# EAGLE design STMConnector (EAGLE 9.3.2)
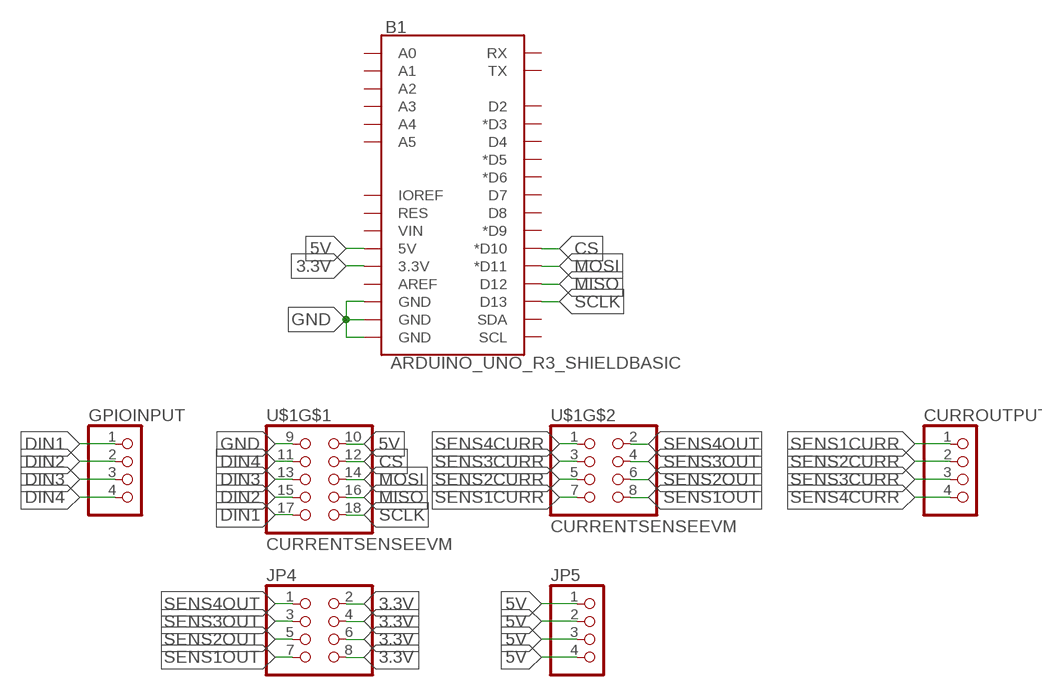
[diagram p0: schematic, sheet 1]

## Parts
B1  ARDUINO_UNO_R3_SHIELDBASIC  [UNO_R3_SHIELD]
CURROUTPUT  PINHD-1X4  [1X04]
GPIOINPUT  PINHD-1X4  [1X04]
JP4  PINHD-2X4  [2X04]
JP5  PINHD-1X4  [1X04]
U$1  CURRENTSENSEEVM  [CURRENTSENSEEVM]

## Nets
3.3V: B1.3.3V JP4.2 JP4.4 JP4.6 JP4.8
5V: B1.5V JP5.1 JP5.2 JP5.3 JP5.4 U$1.10
CS: B1.D10(*D10) U$1.12
DIN1: GPIOINPUT.1 U$1.17
DIN2: GPIOINPUT.2 U$1.15
DIN3: GPIOINPUT.3 U$1.13
DIN4: GPIOINPUT.4 U$1.11
GND: B1.GND@0(GND) B1.GND@1(GND) B1.GND@2(GND) U$1.9
MISO: B1.D12 U$1.16
MOSI: B1.D11(*D11) U$1.14
SCLK: B1.D13 U$1.18
SENS1CURR: CURROUTPUT.1 U$1.7
SENS1OUT: JP4.7 U$1.8
SENS2CURR: CURROUTPUT.2 U$1.5
SENS2OUT: JP4.5 U$1.6
SENS3CURR: CURROUTPUT.3 U$1.3
SENS3OUT: JP4.3 U$1.4
SENS4CURR: CURROUTPUT.4 U$1.1
SENS4OUT: JP4.1 U$1.2
Unconnected: B1.A0 B1.A1 B1.A2 B1.A3 B1.A4 B1.A5 B1.AREF B1.D2 B1.D3(*D3) B1.D4 B1.D5(*D5) B1.D6(*D6) B1.D7 B1.D8 B1.D9(*D9) B1.IOREF B1.RES B1.RX B1.SCL B1.SDA B1.TX B1.VIN

## Library data of the parts
B1 = SparkFun-Boards:ARDUINO_UNO_R3_SHIELD: Arduino R3 Shield Footprint Shield form compatible with the Arduino Uno R3. SparkFun Products: MG2639 Cellular Shield <https://www.sparkfun.com/products/13120> MIDI Shield <https://www.sparkfun.com/products/12898> R3 Stackable Headers Kit <https://www.sparkfun.com/products/11417>
CURROUTPUT GPIOINPUT JP5 = pinhead-currentsense:PINHD-1X4: PIN HEADER
JP4 = pinhead-currentsense:PINHD-2X4: PIN HEADER
U$1 = pinhead-currentsense:CURRENTSENSEEVM

## Board
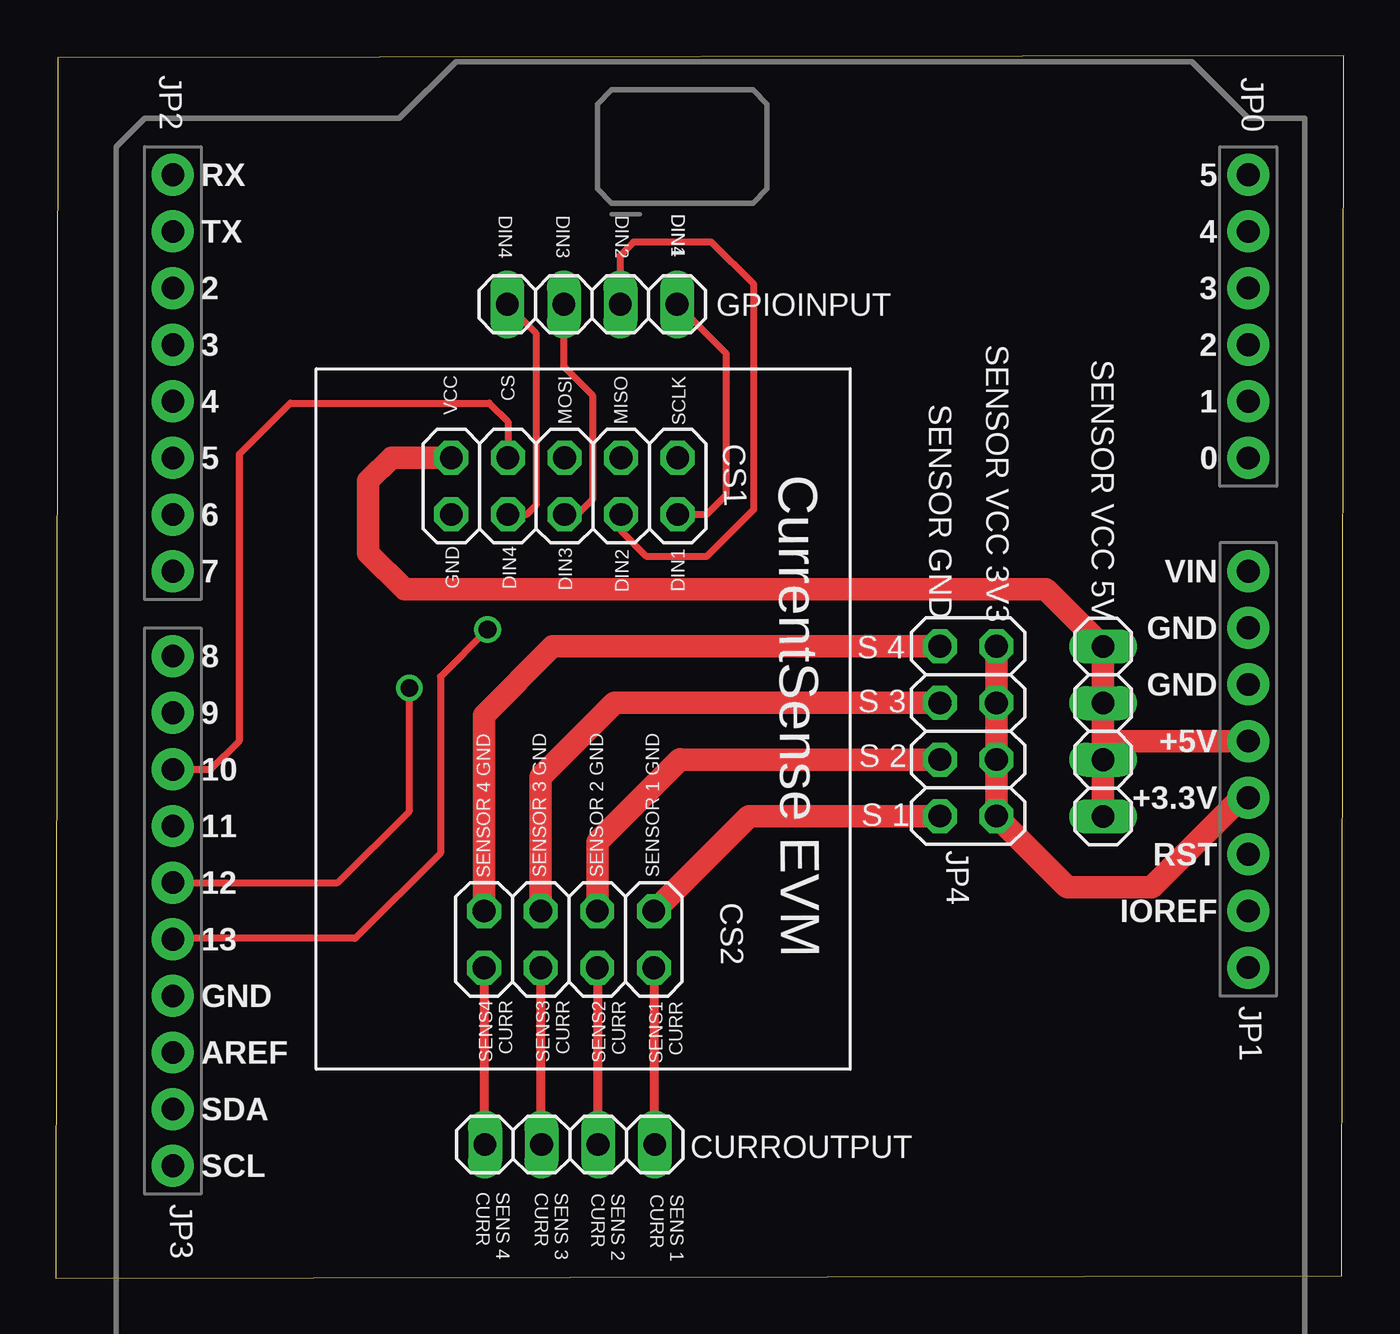
[diagram p1: board, top side]
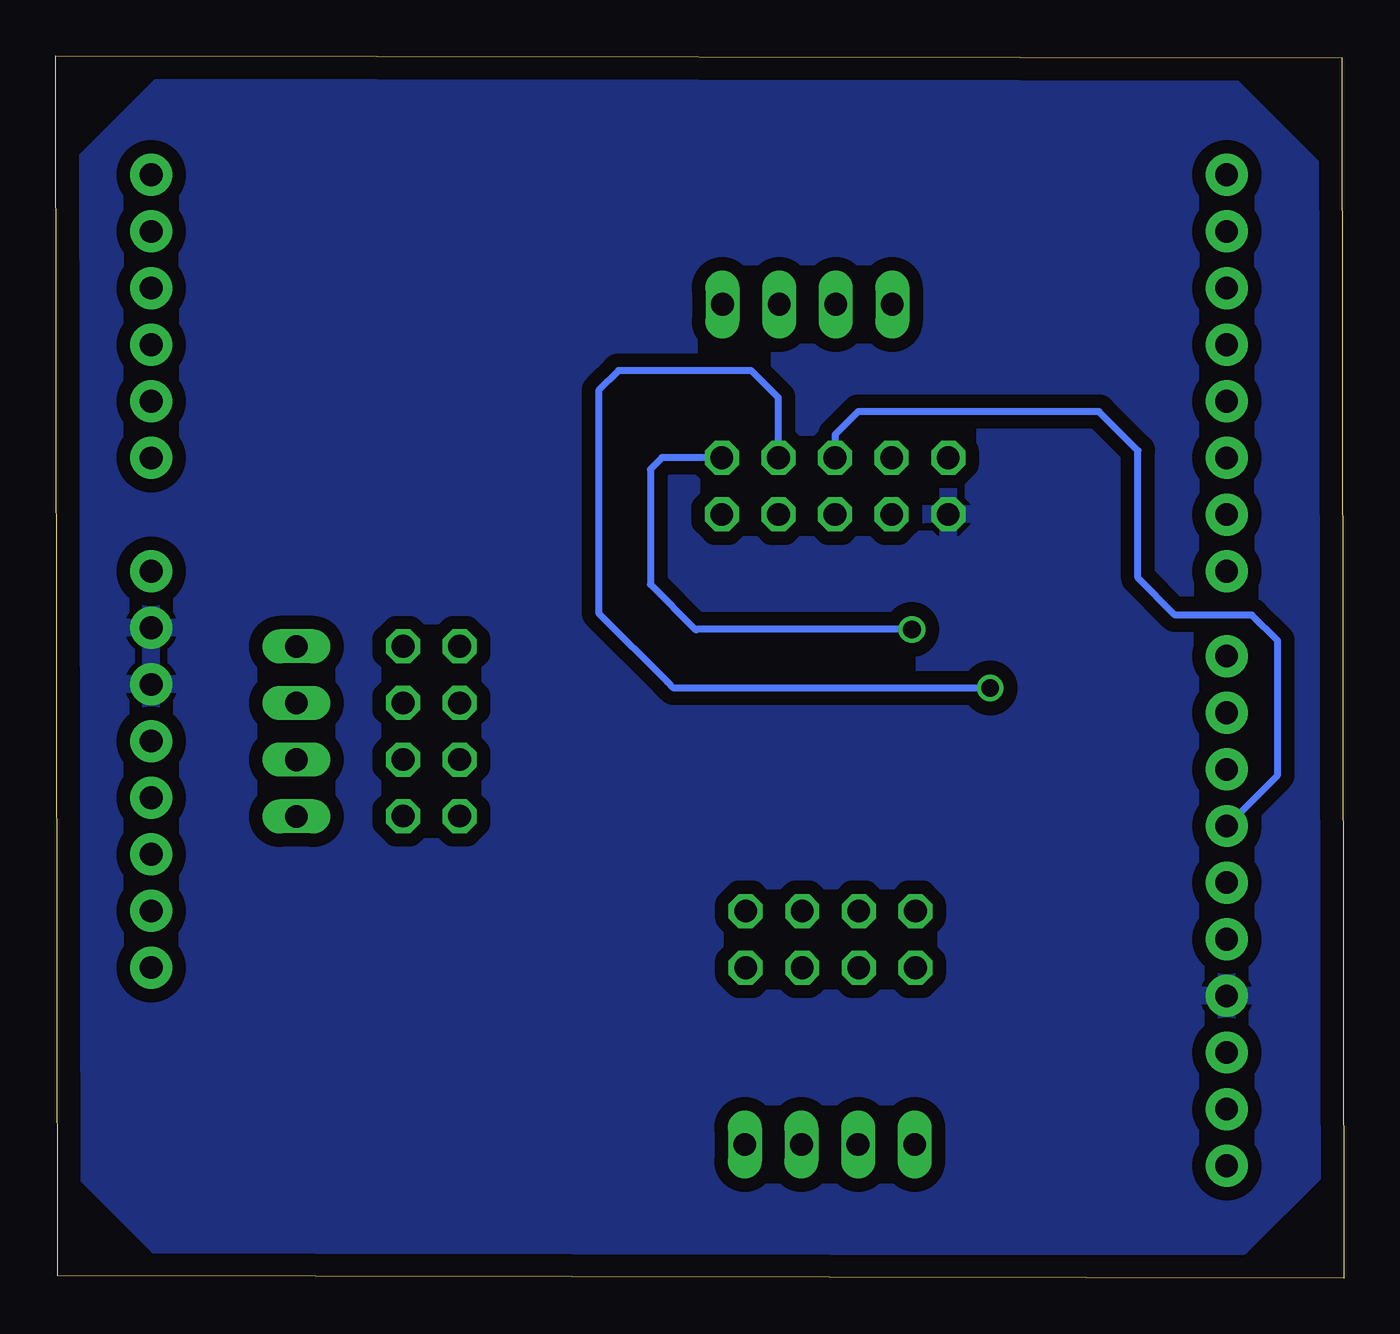
[diagram p2: board, bottom side, seen from below]

Size 57.8 x 54.83 mm. Coordinates in mm from the lower left corner, seen from the top.
Outline: 0,0 57.7,0.1 57.8,54.83 0.1,54.73 0,0
Copper layers (1*16): Top 0.035mm / dielectric 1.5mm / Bottom 0.035mm
Design rules "default": minimum track width 6mil, minimum drill 0.35mm, track to track 6mil, track to pad 6mil, pad to pad 6mil, via to via 6mil, smd to smd 6mil, copper to edge 40mil, drill to drill 6mil, minimum pad ring 10mil, minimum via ring 8mil, stop-mask expansion 4mil, vias tented up to drill 0mil, thermal gap 10mil

### Footprints (pad centres in the part's own frame; a part is rotated, then mirrored left to right if it is on the bottom)
UNO_R3_SHIELD = drill 1.016 pad 1.88: 3.3V 24.13,-2.54; 5V 24.13,0; A0 24.13,12.7; A1 24.13,15.24; A2 24.13,17.78; A3 24.13,20.32; A4 24.13,22.86; A5 24.13,25.4; AREF -24.13,-13.97; D2 -24.13,20.32; D3 -24.13,17.78; D4 -24.13,15.24; D5 -24.13,12.7; D6 -24.13,10.16; D7 -24.13,7.62; D8 -24.13,3.81; D9 -24.13,1.27; D10 -24.13,-1.27; D11 -24.13,-3.81; D12 -24.13,-6.35; D13 -24.13,-8.89; GND@0 24.13,2.54; GND@1 24.13,5.08; GND@2 -24.13,-11.43; IOREF 24.13,-7.62; NC 24.13,-10.16; RES 24.13,-5.08; RX -24.13,25.4; SCL -24.13,-19.05; SDA -24.13,-16.51; TX -24.13,22.86; VIN 24.13,7.62
1X04 = drill 1.016 long: 1 -3.81,0; 2 -1.27,0; 3 1.27,0; 4 3.81,0
2X04 = drill 1.016 octagon: 1 -3.81,-1.27; 2 -3.81,1.27; 3 -1.27,-1.27; 4 -1.27,1.27; 5 1.27,-1.27; 6 1.27,1.27; 7 3.81,-1.27; 8 3.81,1.27
CURRENTSENSEEVM = drill 1.016 octagon: 1 24.147,2.742; 2 21.607,2.742; 3 24.147,5.282; 4 21.607,5.282; 5 24.147,7.822; 6 21.607,7.822; 7 24.147,10.362; 8 21.607,10.362; 9 3.81,1.27; 10 1.27,1.27; 11 3.81,3.81; 12 1.27,3.81; 13 3.81,6.35; 14 1.27,6.35; 15 3.81,8.89; 16 1.27,8.89; 17 3.81,11.43; 18 1.27,11.43

### Placement (x,y rotation side)
B1  29.39,24.09 0 top
CURROUTPUT  23.07,5.99 180 top
GPIOINPUT  24.07,43.68 180 top
JP4  40.94,24.53 270 top
JP5  47,24.52 270 top
U$1  16.48,38.07 270 top

### Tracks (layer width: path | path; a pad name or v marks a point on that pad's centre or on a via)
3.3V
  Top 1.016: JP4.2 JP4.4 JP4.6 JP4.8 45.4,17.53 49.18,17.53 53.2,21.55 B1.3.3V
5V
  Top 1.016: JP5.3 JP5.2 JP5.1 44.44,30.89 15.65,30.89 14.03,32.51 14.03,35.76 15.07,36.8 U$1.10 | JP5.3 JP5.4 | B1.5V 47.83,24.09 JP5.3
CS
  Top 0.305: B1.D10 6.96,22.82 8.25,24.11 8.25,36.97 10.53,39.24 19.45,39.24 20.29,38.41 U$1.12
DIN1
  Top 0.305: GPIOINPUT.1 30.07,41.49 30.07,35.12 29.19,34.24 27.92,34.24 U$1.17
DIN2
  Top 0.305: U$1.15 25.37,33.52 26.5,32.39 29.23,32.39 31.32,34.48 31.32,44.57 29.43,46.47 25.92,46.47 25.32,45.87 25.32,43.7 GPIOINPUT.2
DIN3
  Top 0.305: U$1.13 23.41,34.26 24.1,34.95 24.1,39.58 22.8,40.88 GPIOINPUT.3
DIN4
  Top 0.305: GPIOINPUT.4 21.55,42.39 21.55,34.67 21.12,34.24 20.3,34.24 U$1.11
GND
  pour Bottom (isolate 0.61): 1.29,4.75 4.61,1.42 53.21,1.42 56.64,4.85 56.64,49.95 53,53.58 5.15,53.58 1.16,49.59 1.16,4.9 1.52,4.54 1.5,4.54
MISO  (via drill 0.8)
  Top 0.305: B1.D12 12.66,17.74 15.87,20.95 v15.87,26.47
  Bottom 0.305: U$1.16 25.37,39.49 26.58,40.71 32.55,40.71 33.44,39.81 33.44,29.83 30.35,26.74 30.07,26.47 | 30.07,26.47 30.07,26.46 | v15.87,26.47 30.07,26.47
MOSI
  Bottom 0.305: B1.D11 2.97,22.56 2.97,28.59 4.12,29.74 7.58,29.74 9.24,31.4 9.24,37.12 10.98,38.87 21.8,38.87 22.83,37.83 U$1.14
SCLK  (via drill 0.8)
  Top 0.305: v19.37,29.09 17.26,26.98 17.26,19.06 13.43,15.23 5.29,15.23 B1.D13
  Bottom 0.305: U$1.18 30.59,36.8 31.12,36.27 31.12,31.12 29.06,29.06 29.03,29.09 v19.37,29.09
SENS1CURR
  Top 0.406: U$1.7 26.84,6.03 CURROUTPUT.1
SENS1OUT
  Top 1.016: U$1.8 31.1,20.72 JP4.7
SENS2CURR
  Top 0.406: U$1.5 24.3,6.03 CURROUTPUT.2
SENS2OUT
  Top 1.016: U$1.6 24.3,19.57 28.01,23.28 28.03,23.26 JP4.5
SENS3CURR
  Top 0.406: U$1.3 21.76,6.03 CURROUTPUT.3
SENS3OUT
  Top 1.016: U$1.4 21.76,22.49 25.07,25.8 JP4.3
SENS4CURR
  Top 0.406: U$1.1 19.22,6.03 CURROUTPUT.4
SENS4OUT
  Top 1.016: U$1.2 19.22,25.26 22.31,28.34 JP4.1

### Text on the board
tPlace: JP2 | JP0 | CS1 | CS2 | JP1 | JP3
tNames: DIN4 | DIN3 | DIN2 | DIN1 | DIN4 | SENSOR VCC 3V3 | SENSOR VCC 5V | SENSOR GND | S 4 | S 3 | S 2 | S 1 | CurrentSense EVM | SENS 4 / CURR | SENS 3 / CURR | SENS 2 / CURR | SENS 1 / CURR